# Altium schematic sheet DC_buck_converter_3.3V_OP..SchDoc: DC-DC Buck Converter
size A4; CheckedBy: Ignacio De Mendizabal; Author: Ravi Kumar Dusi; SheetNumber: 1; SheetTotal: 1
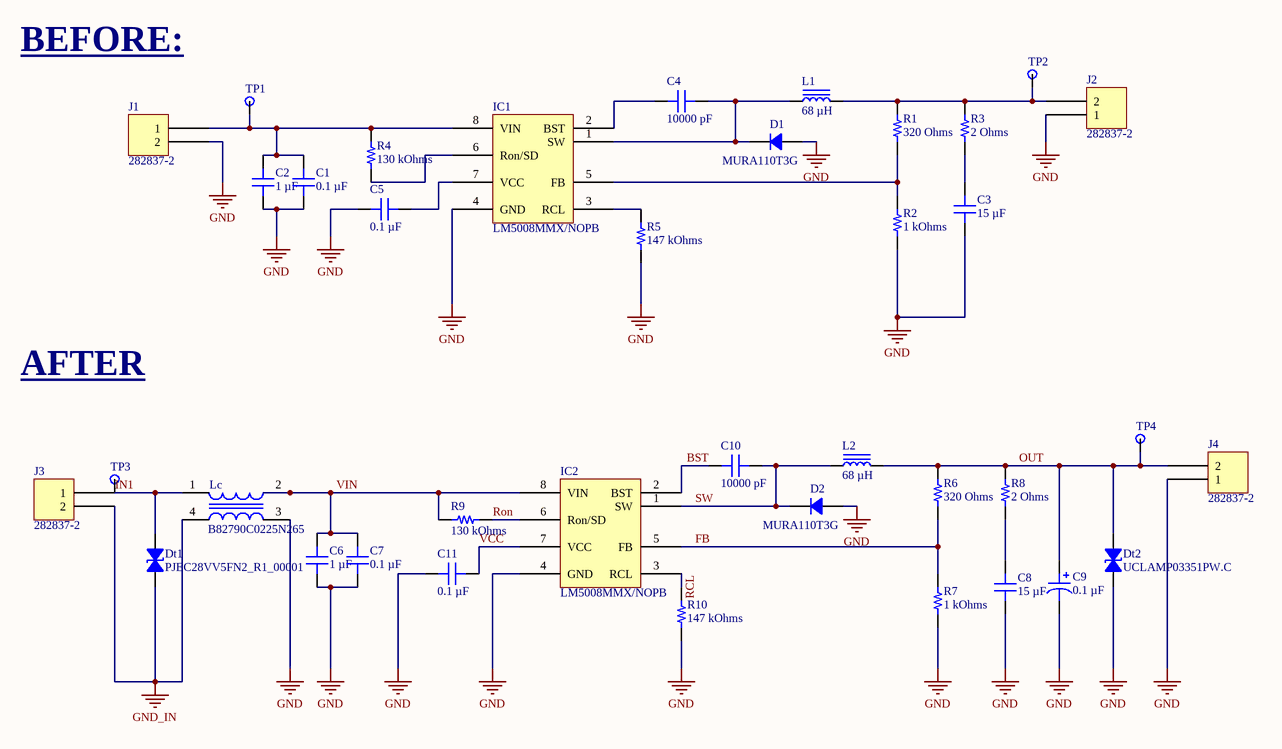
[diagram p0: DC_buck_converter_3.3V_OP..SchDoc]

## Parts
C1  0.1 µF  [CAP 0603_1608]
C2  1 µF  [CAP 0603_1608]
C3  15 µF  [CAP 0603_1608]
C4  10000 pF  [CAP 0603_1608]
C5  0.1 µF  [CAP 0603_1608]
C6  1 µF  [CAP 0603_1608]
C7  0.1 µF  [CAP 0603_1608]
C8  15 µF  [CAP 0603_1608]
C9  0.1 µF  [CAP POL 1206_3216]
C10  10000 pF  [CAP 0603_1608]
C11  0.1 µF  [CAP 0603_1608]
D1  MURA110T3G  [DO214AC SMA]
D2  MURA110T3G  [DO214AC SMA]
Dt1  PJEC28VV5FN2_R1_00001  [0402]
Dt2  UCLAMP03351PW.C  [0402]
IC1  LM5008MMX/NOPB  [TI VSSOP-8 DGK]
IC2  LM5008MMX/NOPB  [TI VSSOP-8 DGK]
J1  282837-2  [TE 282837-2]
J2  282837-2  [TE 282837-2]
J3  282837-2  [TE 282837-2]
J4  282837-2  [TE 282837-2]
L1  68 µH  [BOURNS SRR1280]
L2  68 µH  [TDK SLF10145]
Lc  B82790C0225N265  [FL_B82790C0225N265]
R1  320 Ohms  [RES 0603_1608]
R2  1 kOhms  [RES 0603_1608]
R3  2 Ohms  [RES 0603_1608]
R4  130 kOhms  [RES 0603_1608]
R5  147 kOhms  [RES 0603_1608]
R6  320 Ohms  [RES 0603_1608]
R7  1 kOhms  [RES 0603_1608]
R8  2 Ohms  [RES 0603_1608]
R9  130 kOhms  [RES 0603_1608]
R10  147 kOhms  [RES 0603_1608]
TP1  TP_1  [Testpoint]  (value not drawn)  (no BOM)
TP2  TP_1  [Testpoint]  (value not drawn)  (no BOM)
TP3  TP_1  [Testpoint]  (value not drawn)  (no BOM)
TP4  TP_1  [Testpoint]  (value not drawn)  (no BOM)

## Nets
GND: C1.1 C2.1 C3.1 C5.2 C6.1 C7.1 C8.1 C9.2 C11.2 D1.1 D2.1 Dt2.1 IC1.4(GND) IC2.4(GND) J1.2 J2.1 J4.1 Lc.3 R2.1 R5.2 R7.1 R10.2
GND_IN: Dt1.1 J3.2 Lc.4
BST: C10.1 IC2.2(BST)
FB: IC2.5(FB) R6.1 R7.2
IN1: Dt1.2 J3.1 Lc.1
OUT: C9.1 Dt2.2 J4.2 L2.2 R6.2 R8.2
RCL: IC2.3(RCL) R10.1
Ron: IC2.6(Ron/SD) R9.2
SW: C10.2 D2.2 IC2.1(SW) L2.1
VCC: C11.1 IC2.7(VCC)
VIN: C6.2 C7.2 IC2.8(VIN) Lc.2 R9.1
NetC1_2: C1.2 C2.2 IC1.8(VIN) J1.1 R4.1
NetC3_2: C3.2 R3.1
NetC4_1: C4.1 IC1.2(BST)
NetC4_2: C4.2 D1.2 IC1.1(SW) L1.1
NetC5_1: C5.1 IC1.7(VCC)
NetC8_2: C8.2 R8.1
NetIC1_3: IC1.3(RCL) R5.1
NetIC1_5: IC1.5(FB) R1.1 R2.2
NetIC1_6: IC1.6(Ron/SD) R4.2
NetJ2_2: J2.2 L1.2 R1.2 R3.2

## Notes on the sheet
- BEFORE:
- AFTER
- DOCUMENT NAME:
- TITLE:
- This document is created by Mitai. Any further questions can be asked through
- AUTHOR :
- REVIEWER:
- Sheet
- PART NO.:
- of
- *
- DATE:
- TEMPLATE:
- team@mitai.ai.
- A4
- Contact Address:Rosenheimer Straße 116b,81669, München.

## Library data of the parts
C1 C5 C7 C11 = C0603C104K5RAC7411: CAP CER 0.1UF 50V X7R 0603; manufacturer: KEMET; Tolerance: ±10%; Part Number: C0603C104K5RAC7411; Value: 0.1 µF; Applications: Bypass, Decoupling; Capacitance: 0.1 µF; componentlink1description: Datasheet; componentlink1url: https://api.kemet.com/component-edge/download/datasheet/C0603C104K5RAC7411.pdf; componentlink2description: DigiKey Link; componentlink2url: https://www.digikey.com/en/products/detail/kemet/C0603C104K5RAC7411/3317013; Device Package: 0603 (1608 Metric); lastupdated: 01/10/2023 19:09:12; Lifecycle Status: Active; Minimum Order: 1; Mounting Type: Surface Mount, MLCC; Operating Temperature: -55°C ~ 125°C; Package / Case: 0603 (1608 Metric); packaging: TapeAndReel; partid: 2233; Part Status: Active; price: 0.01; series: SMD Comm X7R; Size / Dimension: 0.063" L x 0.031" W (1.60mm x 0.80mm); Supplier 1: DigiKey; Supplier Part Number 1: 399-C0603C104K5RAC7411CT-ND; Temperature Coefficient: X7R; Thickness (Max): 0.035" (0.90mm); Voltage - Rated: 50V
C2 C6 = UMK107ABJ105MAHT: CAP CER 1UF 50V X5R 0603; manufacturer: Taiyo Yuden; Tolerance: ±20%; Part Number: UMK107ABJ105MAHT; Value: 1 µF; Applications: Automotive, SMPS Filtering; Capacitance: 1 µF; componentlink1description: Datasheet; componentlink1url: https://www.yuden.co.jp/productdata/catalog/mlcc_all_hq_e.pdf; componentlink2description: DigiKey Link; componentlink2url: https://www.digikey.com/en/products/detail/taiyo-yuden/UMK107ABJ105MAHT/6563551; Device Package: 0603 (1608 Metric); lastupdated: 01/10/2023 19:09:10; Lifecycle Status: Active; Minimum Order: 1; Mounting Type: Surface Mount, MLCC; Operating Temperature: -55°C ~ 85°C; Package / Case: 0603 (1608 Metric); packaging: TapeAndReel; partid: 3194; Part Status: Active; price: 0.03; Ratings: AEC-Q200; series: M; Size / Dimension: 0.063" L x 0.031" W (1.60mm x 0.80mm); Supplier 1: DigiKey; Supplier Part Number 1: 587-4958-1-ND; Temperature Coefficient: X5R; Thickness (Max): 0.037" (0.95mm); Voltage - Rated: 50V
C3 C8 = C1608X5R0J156M080AC: CAP CER 15UF 6.3V X5R 0603; manufacturer: TDK Corporation; Tolerance: ±20%; Part Number: C1608X5R0J156M080AC; Value: 15 µF; Applications: General Purpose; Capacitance: 15 µF; componentlink1description: Datasheet; componentlink1url: https://product.tdk.com/info/en/catalog/datasheets/mlcc_commercial_general_en.pdf?ref_disty=digikey; componentlink2description: DigiKey Link; componentlink2url: https://www.digikey.com/en/products/detail/tdk-corporation/C1608X5R0J156M080AC/2792253; Device Package: 0603 (1608 Metric); Features: Low ESL; lastupdated: 01/10/2023 19:09:11; Lifecycle Status: Active; Minimum Order: 1; Mounting Type: Surface Mount, MLCC; Operating Temperature: -55°C ~ 85°C; Package / Case: 0603 (1608 Metric); packaging: TapeAndReel; partid: 2610; Part Status: Active; price: 0.07; series: C; Size / Dimension: 0.063" L x 0.031" W (1.60mm x 0.80mm); Supplier 1: DigiKey; Supplier Part Number 1: 445-8027-1-ND; Temperature Coefficient: X5R; Thickness (Max): 0.039" (1.00mm); Voltage - Rated: 6.3V
C4 C10 = AC0603KRX7R0BB103: CAP CER 10000PF 100V X7R 0603; manufacturer: Yageo; Tolerance: ±10%; Part Number: AC0603KRX7R0BB103; Value: 10000 pF; Applications: Automotive; Capacitance: 10000 pF; componentlink1description: Datasheet; componentlink1url: http://www.yageo.com/NewPortal/_en/search/productDocs.jsp?YageoPartNumber=AC0603KRX7R0BB103; componentlink2description: DigiKey Link; componentlink2url: https://www.digikey.com/en/products/detail/yageo/AC0603KRX7R0BB103/6643086; Device Package: 0603 (1608 Metric); lastupdated: 01/10/2023 19:09:12; Lifecycle Status: Active; Minimum Order: 1; Mounting Type: Surface Mount, MLCC; Operating Temperature: -55°C ~ 125°C; Package / Case: 0603 (1608 Metric); packaging: TapeAndReel; partid: 2218; Part Status: Active; price: 0.01; Ratings: AEC-Q200; series: AC; Size / Dimension: 0.063" L x 0.031" W (1.60mm x 0.80mm); Supplier 1: DigiKey; Supplier Part Number 1: 311-3100-1-ND; Temperature Coefficient: X7R; Thickness (Max): 0.035" (0.90mm); Voltage - Rated: 100V
C9 = T494A104K035AT: CAP TANT 0.1UF 10% 35V 1206; manufacturer: KEMET; Manufacturer Size Code: A; ESR (Equivalent Series Resistance): 10Ohm; Lifetime @ Temp.: 2000 Hrs @ 125°C; Type: Molded; Part Number: T494A104K035AT; Value: 0.1 µF; Capacitance: 0.1 µF; componentlink1description: Datasheet; componentlink1url: https://api.kemet.com/component-edge/download/datasheet/T494A104K035AT.pdf; componentlink2description: DigiKey Link; componentlink2url: https://www.digikey.com/en/products/detail/kemet/T494A104K035AT/3759695; Device Package: 1206 (3216 Metric); Features: General Purpose; Height - Seated (Max): 0.071" (1.80mm); lastupdated: 26/11/2023 21:00:31; Lifecycle Status: Active; Minimum Order: 1; Mounting Type: Surface Mount; Operating Temperature: -55°C ~ 125°C; Package / Case: 1206 (3216 Metric); packaging: TapeAndReel; partid: 208; Part Status: Active; price: 0.14; series: T494; Size / Dimension: 0.126" L x 0.063" W (3.20mm x 1.60mm); Supplier 1: DigiKey; Supplier Part Number 1: 399-10216-1-ND; Tolerance: ±10%; Voltage - Rated: 35 V
D1 D2 = MURA110T3G: DIODE GEN PURP 100V 2A SMA; Manufacturer: ON Semiconductor; Current - Reverse Leakage @ Vr: 2µA @ 100V; Diode Type: Standard; Reverse Recovery Time (trr): 30ns; Speed: Fast Recovery =< 500ns, > 200mA (Io); Voltage - Forward (Vf) (Max) @ If: 875mV @ 1A; Part Number: MURA110T3G; ComponentLink1Description: Datasheet; ComponentLink1URL: //media.digikey.com/pdf/Data%20Sheets/ON%20Semiconductor%20PDFs/MURA105T3-D.pdf; ComponentLink2Description: DigiKey Link; ComponentLink2URL: http://digikey.com/product-detail/en/on-semiconductor/MURA110T3G/MURA110T3GOSCT-ND/964568; Current - Average Rectified (Io): 2A; LastUpdated: 01/10/2023 20:19:19; Lifecycle Status: Active; Minimum Order: 1; Mounting Type: Surface Mount; Operating Temperature - Junction: -65°C ~ 175°C; Package / Case: DO-214AC, SMA; Packaging: TapeAndReel; PartId: 641; Part Status: Active; Price: 0.10; Series: -; Supplier 1: DigiKey; Supplier Part Number 1: MURA110T3GOSCT-ND; Supplier Device Package: SMA; Voltage - DC Reverse (Vr) (Max): 100V
Dt1 = PJEC28VV5FN2_R1_00001: ESD PROTECTION; Manufacturer: Panjit International Inc.; Bidirectional Channels: 1; Capacitance @ Frequency: 5pF @ 1MHz (Max); Current - Peak Pulse (10/1000µs): 1A (8/20µs); Power Line Protection: No; Voltage - Breakdown (Min): 30V; Voltage - Clamping (Max) @ Ipp: 50V; Voltage - Reverse Standoff (Typ): 28V (Max); Part Number: PJEC28VV5FN2_R1_00001; Applications: General Purpose; ComponentLink2Description: DigiKey Link; ComponentLink2URL: https://www.digikey.com/en/products/detail/panjit-international-inc/PJEC28VV5FN2-R1-00001/15798575; Device Package: 0402 (1005 Metric); LastUpdated: 05/12/2023 21:45:21; Lifecycle Status: Active; Minimum Order: 1; Mounting Type: Surface Mount; Operating Temperature: -55°C ~ 150°C (TJ); Package / Case: 0402 (1005 Metric); Packaging: TapeAndReel; PartId: 11643; Part Status: Active; Price: 0.06; Series: -; Supplier 1: DigiKey; Supplier Part Number 1: 3757-PJEC28VV5FN2_R1_00001CT-ND; Supplier Device Package: 2-DFN (1x0.6); Type: Zener
Dt2 = UCLAMP03351PW.C: 3,3V ESD & EOS PROTECTION; Manufacturer: Semtech Corporation; Bidirectional Channels: 1; Capacitance @ Frequency: 4.7pF @ 1MHz; Current - Peak Pulse (10/1000µs): 6A (8/20µs); Power Line Protection: No; Power - Peak Pulse: 40W; Voltage - Breakdown (Min): 3.8V; Voltage - Clamping (Max) @ Ipp: 6.5V; Voltage - Reverse Standoff (Typ): 3.3V (Max); Part Number: UCLAMP03351PW.C; Applications: General Purpose; ComponentLink1Description: Datasheet; ComponentLink1URL: https://semtech.my.salesforce.com/sfc/p/#E0000000JelG/a/3n000000qPoT/ng0FFZi8ACANWoaqiIO_glB9bbOFnd4tC4a0u4INqfQ; ComponentLink2Description: DigiKey Link; ComponentLink2URL: https://www.digikey.com/en/products/detail/semtech-corporation/UCLAMP03351PW-C/21371831; Device Package: 0402 (1005 Metric); LastUpdated: 05/12/2023 21:45:19; Lifecycle Status: Active; Minimum Order: 1; Mounting Type: Surface Mount; Operating Temperature: -40°C ~ 125°C (TA); Package / Case: 0402 (1005 Metric); Packaging: TapeAndReel; PartId: 11839; Price: 0.13; Series: µClamp®; Supplier 1: DigiKey; Supplier Part Number 1: 600-UCLAMP03351PW.CCT-ND; Supplier Device Package: 2-DFN (1x0.6); Type: Zener
IC1 IC2 = LM5008MMX/NOPB: IC REG BUCK ADJ 350MA 8VSSOP; Manufacturer: Texas Instruments; Frequency - Switching: 50kHz ~ 600kHz; Function: Step-Down; Number of Outputs: 1; Output Configuration: Positive; Output Type: Adjustable; Synchronous Rectifier: No; Voltage - Input (Max): 95V; Voltage - Input (Min): 9.5V; Voltage - Output (Max): 75V; Voltage - Output (Min/Fixed): 2.5V; Part Number: LM5008MMX/NOPB; ComponentLink1Description: Datasheet; ComponentLink1URL: http://www.ti.com/general/docs/suppproductinfo.tsp?distId=10&gotoUrl=http%3A%2F%2Fwww.ti.com%2Flit%2Fgpn%2Flm5008; ComponentLink2Description: DigiKey Link; ComponentLink2URL: //digikey.com/product-detail/en/texas-instruments/LM5008MMX-NOPB/296-35288-2-ND/1871803; Current - Output: 350mA; Device Package: 8-TSSOP, 8-MSOP (0.118", 3.00mm Width); LastUpdated: 12/12/2019 10:27:36; Lifecycle Status: 0; Minimum Order: 1; Mounting Type: Surface Mount; Operating Temperature: -40°C ~ 125°C (TJ); Package / Case: 8-TSSOP, 8-MSOP (0.118", 3.00mm Width); Packaging: TapeAndReel; Part Status: Active; Price: 1.30; Series: -; Supplier 1: DigiKey; Supplier Part Number 1: 296-35288-2-ND; Supplier Device Package: 8-VSSOP; Topology: Buck
J1-J4 = 282837-2: TERM BLK 2P SIDE ENT 5.08MM PCB; Manufacturer: TE Connectivity AMP Connectors; Current: 13.5 A; Mating Orientation: Horizontal with Board; Number of Levels: 1; Pitch: 0.200" (5.08mm); Positions Per Level: 2; Voltage: 300 V; Wire Gauge: 16-28 AWG; Wire Termination: Screw - Rising Cage Clamp; Part Number: 282837-2; Color: Green; ComponentLink1Description: Datasheet; ComponentLink1URL: https://www.te.com/commerce/DocumentDelivery/DDEController?Action=srchrtrv&DocNm=282837&DocType=Customer+Drawing&DocLang=English; ComponentLink2Description: DigiKey Link; ComponentLink2URL: https://www.digikey.com/en/products/detail/te-connectivity-amp-connectors/282837-2/2187973; Features: Interlocking (Side); LastUpdated: 21/06/2022 15:00:23; Lifecycle Status: Active; Minimum Order: 1; Mounting Type: Through Hole; Packaging: Tray; Part Status: Active; Price: 0.31; Series: Buchanan; Supplier 1: DigiKey; Supplier Part Number 1: A113320-ND
L1 = SRR1280-680M: FIXED IND 68UH 2.4A 120 MOHM SMD; Manufacturer: Bourns Inc.; Current - Saturation: 2.3A; DC Resistance (DCR): 120mOhm Max; Frequency - Self Resonant: 6.5MHz; Inductance Frequency - Test: 100 kHz; Material - Core: Ferrite; Q @ Freq: 20 @ 2.52MHz; Shielding: Shielded; Tolerance: ±20%; Type: Drum Core, Wirewound; Part Number: SRR1280-680M; ComponentLink1Description: Datasheet; ComponentLink1URL: https://www.bourns.com/docs/Product-Datasheets/SRR1280.pdf; ComponentLink2Description: DigiKey Link; ComponentLink2URL: https://www.digikey.com/en/products/detail/bourns-inc/SRR1280-680M/1970002; Current Rating (Amps): 2.4 A; Device Package: Nonstandard; Height - Seated (Max): 0.315" (8.00mm); Inductance: 68 µH; LastUpdated: 01/10/2023 20:27:20; Lifecycle Status: Active; Minimum Order: 1; Mounting Type: Surface Mount; Operating Temperature: -40°C ~ 125°C; Package / Case: Nonstandard; Packaging: TapeAndReel; PartId: 42; Part Status: Active; Price: 0.51; Series: SRR1280; Size / Dimension: 0.492" L x 0.492" W (12.50mm x 12.50mm); Supplier 1: DigiKey; Supplier Part Number 1: SRR1280-680MCT-ND; Value: 68 µH
L2 = SLF10145T-680M1R2-PF: FIXED IND 68UH 1.3A 168 MOHM SMD; Manufacturer: TDK Corporation; Current - Saturation: 1.2A; DC Resistance (DCR): 168mOhm Max; Inductance Frequency - Test: 1 kHz; Material - Core: Ferrite; Shielding: Shielded; Tolerance: ±20%; Type: Drum Core, Wirewound; Part Number: SLF10145T-680M1R2-PF; ComponentLink1Description: Datasheet; ComponentLink1URL: https://product.tdk.com/info/en/catalog/datasheets/inductor_commercial_power_slf10145_en.pdf?ref_disty=digikey; ComponentLink2Description: DigiKey Link; ComponentLink2URL: https://www.digikey.com/en/products/detail/tdk-corporation/SLF10145T-680M1R2-PF/755339; Current Rating (Amps): 1.3 A; Device Package: Nonstandard; Height - Seated (Max): 0.189" (4.80mm); Inductance: 68 µH; LastUpdated: 12/07/2023 20:19:31; Lifecycle Status: Active; Minimum Order: 1; Mounting Type: Surface Mount; Operating Temperature: -40°C ~ 105°C; Package / Case: Nonstandard; Packaging: TapeAndReel; PartId: 81; Part Status: Active; Price: 0.44; Series: SLF; Size / Dimension: 0.398" L x 0.398" W (10.10mm x 10.10mm); Supplier 1: DigiKey; Supplier Part Number 1: 445-1987-1-ND; Value: 68 µH
Lc = B82790C0225N265: Common Mode Filter / Choke, 0.005 - 4.7 mH, 200 - 1000 mA; MF: EPCOS; SnapEDA_Link: https://www.snapeda.com/parts/B82790C0225N265/EPCOS/view-part/?ref=snap; Package: NON STANDARD-4 TDK; Value: *; MP: B82790C0225N265; Check_prices: https://www.snapeda.com/parts/B82790C0225N265/EPCOS/view-part/?ref=eda
R1 R6 = RT0603DRE07320RL: RES 320 OHM 0.5% 1/10W 0603; Manufacturer: Yageo; Power (Watts): 0.1W, 1/10W; Temperature Coefficient: ±50ppm/°C; Part Number: RT0603DRE07320RL; Value: 320 Ohms; ComponentLink1Description: Datasheet; ComponentLink1URL: https://www.yageo.com/upload/media/product/productsearch/datasheet/rchip/PYu-RT_1-to-0.01_RoHS_L_12.pdf; ComponentLink2Description: DigiKey Link; ComponentLink2URL: https://www.digikey.com/en/products/detail/yageo/RT0603DRE07320RL/7708418; Composition: Thin Film; Device Package: 0603 (1608 Metric); Height - Seated (Max): 0.022" (0.55mm); LastUpdated: 01/10/2023 19:33:29; Lifecycle Status: Active; Minimum Order: 1; Number of Terminations: 2; Operating Temperature: -55°C ~ 155°C; Package / Case: 0603 (1608 Metric); Packaging: TapeAndReel; PartId: 62448; Part Status: Active; Price: 0.01; Resistance: 320 Ohms; Series: RT; Size / Dimension: 0.063" L x 0.031" W (1.60mm x 0.80mm); Supplier 1: DigiKey; Supplier Part Number 1: 13-RT0603DRE07320RLCT-ND; Supplier Device Package: 0603; Tolerance: ±0.5%
R2 R7 = AT0603DRD071KL: RES SMD 1K OHM 0.5% 1/10W 0603; Manufacturer: Yageo; Power (Watts): 0.1W, 1/10W; Temperature Coefficient: ±25ppm/°C; Part Number: AT0603DRD071KL; Value: 1 kOhms; ComponentLink1Description: Datasheet; ComponentLink1URL: http://www.yageo.com/documents/recent/PYu-AT_51_RoHS_L_5.pdf; ComponentLink2Description: DigiKey Link; ComponentLink2URL: https://www.digikey.com/en/products/detail/yageo/AT0603DRD071KL/5138634; Composition: Thin Film; Device Package: 0603 (1608 Metric); Features: Anti-Sulfur, Automotive AEC-Q200, Moisture Resistant; Height - Seated (Max): 0.022" (0.55mm); LastUpdated: 01/10/2023 19:35:39; Lifecycle Status: Active; Minimum Order: 1; Number of Terminations: 2; Operating Temperature: -55°C ~ 155°C; Package / Case: 0603 (1608 Metric); Packaging: TapeAndReel; PartId: 4899; Part Status: Active; Price: 0.02; Ratings: AEC-Q200; Resistance: 1 kOhms; Series: AT; Size / Dimension: 0.063" L x 0.031" W (1.60mm x 0.80mm); Supplier 1: DigiKey; Supplier Part Number 1: YAG2115CT-ND; Supplier Device Package: 0603; Tolerance: ±0.5%
R3 R8 = SFR03EZPJ2R0: SULFUR TOLERANT CHIP RESISTORS; Manufacturer: Rohm Semiconductor; Power (Watts): 0.1W, 1/10W; Temperature Coefficient: ±400ppm/°C; Tolerance: ±5%; Part Number: SFR03EZPJ2R0; Value: 2 Ohms; ComponentLink1Description: Datasheet; ComponentLink1URL: https://fscdn.rohm.com/en/products/databook/datasheet/passive/resistor/chip_resistor/sfr-e.pdf; ComponentLink2Description: DigiKey Link; ComponentLink2URL: https://www.digikey.com/en/products/detail/rohm-semiconductor/SFR03EZPJ2R0/16179956; Composition: Thick Film; Device Package: 0603 (1608 Metric); Features: Anti-Sulfur, Automotive AEC-Q200; Height - Seated (Max): 0.022" (0.55mm); LastUpdated: 01/10/2023 19:33:15; Lifecycle Status: Active; Minimum Order: 1; Number of Terminations: 2; Operating Temperature: -55°C ~ 155°C; Package / Case: 0603 (1608 Metric); Packaging: TapeAndReel; PartId: 68512; Part Status: Active; Price: 0.01; Ratings: AEC-Q200; Resistance: 2 Ohms; Series: SFR; Size / Dimension: 0.063" L x 0.031" W (1.60mm x 0.80mm); Supplier 1: DigiKey; Supplier Part Number 1: 511-SFR03EZPJ2R0CT-ND; Supplier Device Package: 0603
R4 R9 = CRCW0603130KFKEA: RES SMD 130K OHM 1% 1/10W 0603; Manufacturer: Vishay Dale; Power (Watts): 0.1W, 1/10W; Temperature Coefficient: ±100ppm/°C; Part Number: CRCW0603130KFKEA; Value: 130 kOhms; ComponentLink1Description: Datasheet; ComponentLink1URL: http://www.vishay.com/docs/20035/dcrcwe3.pdf; ComponentLink2Description: DigiKey Link; ComponentLink2URL: https://www.digikey.com/en/products/detail/vishay-dale/CRCW0603130KFKEA/1174908; Composition: Thick Film; Device Package: 0603 (1608 Metric); Features: Automotive AEC-Q200; Height - Seated (Max): 0.020" (0.50mm); LastUpdated: 01/10/2023 19:35:07; Lifecycle Status: Active; Minimum Order: 1; Number of Terminations: 2; Operating Temperature: -55°C ~ 155°C; Package / Case: 0603 (1608 Metric); Packaging: CutTape; PartId: 12812; Part Status: Active; Price: 0.01; Ratings: AEC-Q200; Resistance: 130 kOhms; Series: CRCW; Size / Dimension: 0.061" L x 0.033" W (1.55mm x 0.85mm); Supplier 1: DigiKey; Supplier Part Number 1: 541-130KHCT-ND; Supplier Device Package: 0603; Tolerance: ±1%
R5 R10 = RT0603BRD07147KL: RES SMD 147K OHM 0.1% 1/10W 0603; Manufacturer: Yageo; Power (Watts): 0.1W, 1/10W; Temperature Coefficient: ±25ppm/°C; Part Number: RT0603BRD07147KL; Value: 147 kOhms; ComponentLink1Description: Datasheet; ComponentLink1URL: https://www.yageo.com/upload/media/product/productsearch/datasheet/rchip/PYu-RT_1-to-0.01_RoHS_L_11.pdf; ComponentLink2Description: DigiKey Link; ComponentLink2URL: https://www.digikey.com/en/products/detail/yageo/RT0603BRD07147KL/1072250; Composition: Thin Film; Device Package: 0603 (1608 Metric); Height - Seated (Max): 0.022" (0.55mm); LastUpdated: 01/10/2023 19:35:22; Lifecycle Status: Active; Minimum Order: 1; Number of Terminations: 2; Operating Temperature: -55°C ~ 155°C; Package / Case: 0603 (1608 Metric); Packaging: TapeAndReel; PartId: 9271; Part Status: Active; Price: 0.03; Resistance: 147 kOhms; Series: RT; Size / Dimension: 0.063" L x 0.031" W (1.60mm x 0.80mm); Supplier 1: DigiKey; Supplier Part Number 1: YAG4475CT-ND; Supplier Device Package: 0603; Tolerance: ±0.1%
TP1-TP4 = Testpoint